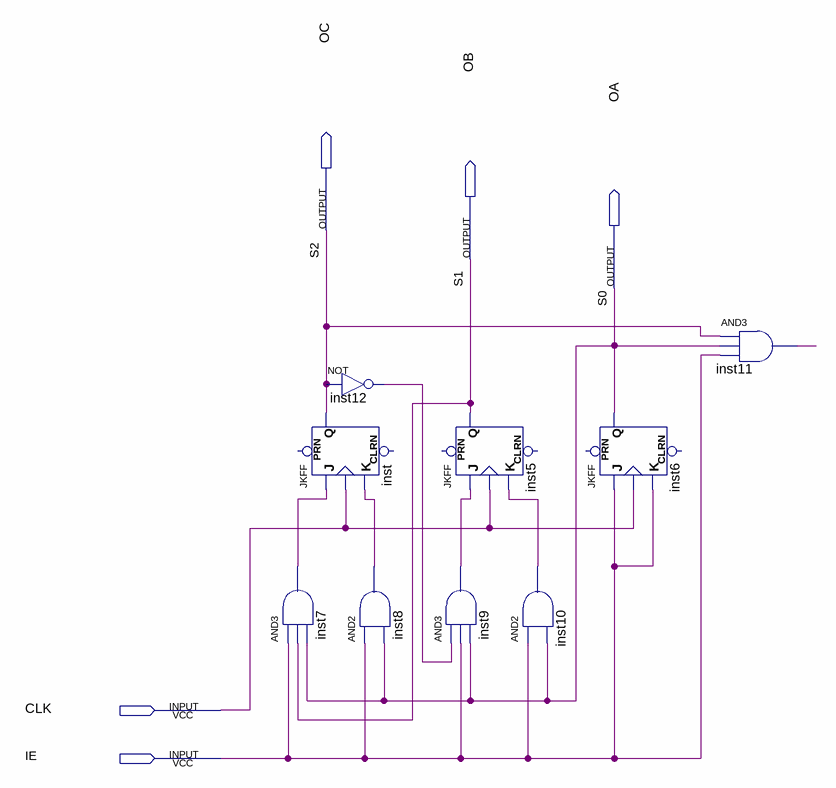
[diagram p0: schematic sheet]
// Quartus schematic mod_6_counter_with_enable.bdf as structural Verilog: 9 symbols, 5 pins
module mod_6_counter_with_enable (
  input  CLK,
  input  IE,
  output OC,
  output OB,
  output OA
);

  wire inst7_out, inst8_out, inst9_out, inst10_out, inst11_out, inst12_out;

  and inst7 (inst7_out, IE, OB, OA);
  not inst12 (inst12_out, OC);
  JKFF inst (.K(inst8_out), .J(inst7_out), .CLK(CLK), .Q(OC));  // open: PRN, CLRN
  and inst8 (inst8_out, IE, OA);
  and inst9 (inst9_out, inst12_out, IE, OA);
  JKFF inst5 (.K(inst10_out), .J(inst9_out), .CLK(CLK), .Q(OB));  // open: PRN, CLRN
  and inst10 (inst10_out, IE, OA);
  JKFF inst6 (.K(IE), .J(IE), .CLK(CLK), .Q(OA));  // open: PRN, CLRN
  and inst11 (inst11_out, OC, OA, IE);

  // Other names for the same wires on the sheet: S0 = OA; S1 = OB; S2 = OC
endmodule
